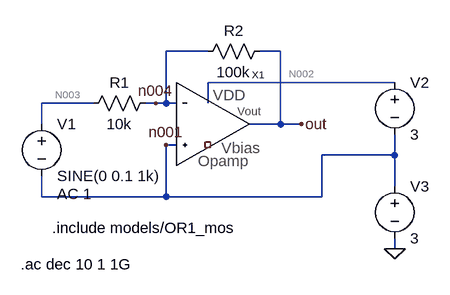
[diagram p0: schematic ishibe_tb.asc]
ishibe_tb.asc, the LTspice schematic file:
Version 4
SHEET 1 880 680
WIRE 144 32 80 32
WIRE 256 32 224 32
WIRE 432 80 144 80
WIRE -32 112 -112 112
WIRE 64 112 48 112
WIRE 80 112 80 32
WIRE 80 112 64 112
WIRE 96 112 80 112
WIRE 144 112 144 80
WIRE -112 144 -112 112
WIRE 256 144 256 32
WIRE 256 144 208 144
WIRE 288 144 256 144
WIRE 96 176 80 176
WIRE 432 192 432 160
WIRE 432 192 320 192
WIRE 432 240 432 192
WIRE -112 256 -112 224
WIRE 80 256 80 176
WIRE 80 256 -112 256
WIRE 320 256 320 192
WIRE 320 256 80 256
WIRE 432 336 432 320
FLAG 432 336 0
FLAG 288 144 out
FLAG 64 112 n004
FLAG 80 176 n001
SYMBOL Opamp3ureiauto 176 144 R0
SYMATTR InstName X1
SYMBOL res 64 96 R90
WINDOW 0 0 56 VBottom 2
WINDOW 3 32 56 VTop 2
SYMATTR InstName R1
SYMATTR Value 10k
SYMBOL res 240 16 R90
WINDOW 0 0 56 VBottom 2
WINDOW 3 32 56 VTop 2
SYMATTR InstName R2
SYMATTR Value 100k
SYMBOL voltage -112 128 R0
WINDOW 123 24 124 Left 2
WINDOW 39 0 0 Left 2
SYMATTR Value2 AC 1
SYMATTR InstName V1
SYMATTR Value SINE(0 0.1 1k)
SYMBOL voltage 432 64 R0
SYMATTR InstName V2
SYMATTR Value 3
SYMBOL voltage 432 224 R0
SYMATTR InstName V3
SYMATTR Value 3
TEXT -96 304 Left 2 !.include models/OR1_mos
TEXT -144 360 Left 2 !.ac dec 10 1 1G

The netlist it stands for:
* ishibe_tb.asc
XX1 n004 n001 out N002 NC_01 Opamp3ureiauto  ; pins Vinm Vinp Vout VDD Vbias
R1 n004 N003 10k
R2 out n004 100k
V1 N003 n001 SINE(0 0.1 1k) AC 1
V2 N002 n001 3
V3 n001 0 3
.include models/OR1_mos
.ac dec 10 1 1G
.backanno
.end

* Results of the author's LTspice run, read from the files saved beside the schematic
* Operating Point, zero values left out:
*   V(out) = 3 V
*   V(n002) = 6 V
*   V(n004) = 3 V
*   V(n001) = 3 V
*   V(n003) = 3 V
*   I(R2) = -1.223 nA
*   I(R1) = -1.223 nA
*   I(V3) = -539.5 µA
*   I(V2) = -539.5 µA
*   I(V1) = -1.223 nA
*   Ix(x1:VOUT) = 1.223 nA
*   Ix(x1:VDD) = 539.5 µA
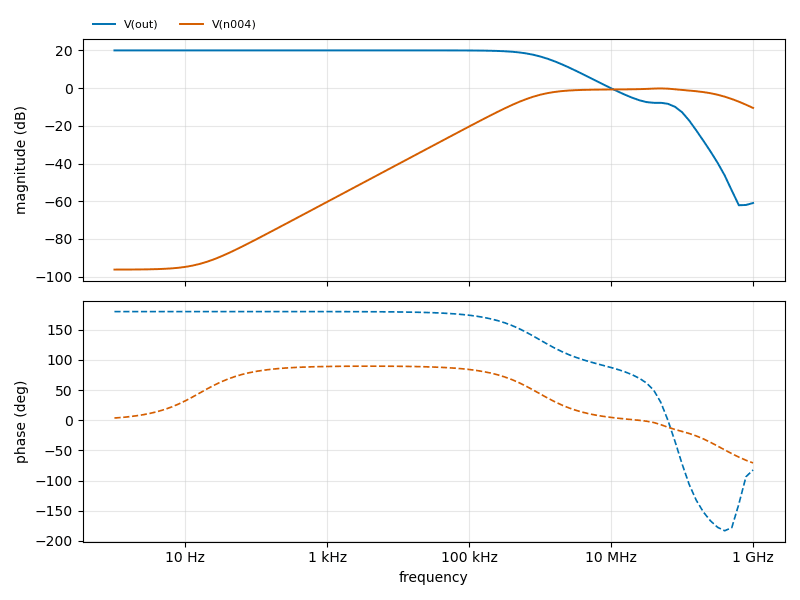
[diagram p1: AC Analysis of ishibe_tb.asc, plotted from the saved traces]
* AC Analysis, 1 run:
*   V(out): 20.00 dB at 1 Hz, -60.96 dB at 1 GHz, peak 20.00 dB at 1 Hz, 3 dB below the peak at 949.7 kHz
*   V(n004): -96.27 dB at 1 Hz, -10.53 dB at 1 GHz, peak -0.16 dB at 50.12 MHz, 3 dB below the peak at 1.101 MHz and 286.6 MHz